# EAGLE schematic Humidity (EAGLE 7.2.0)
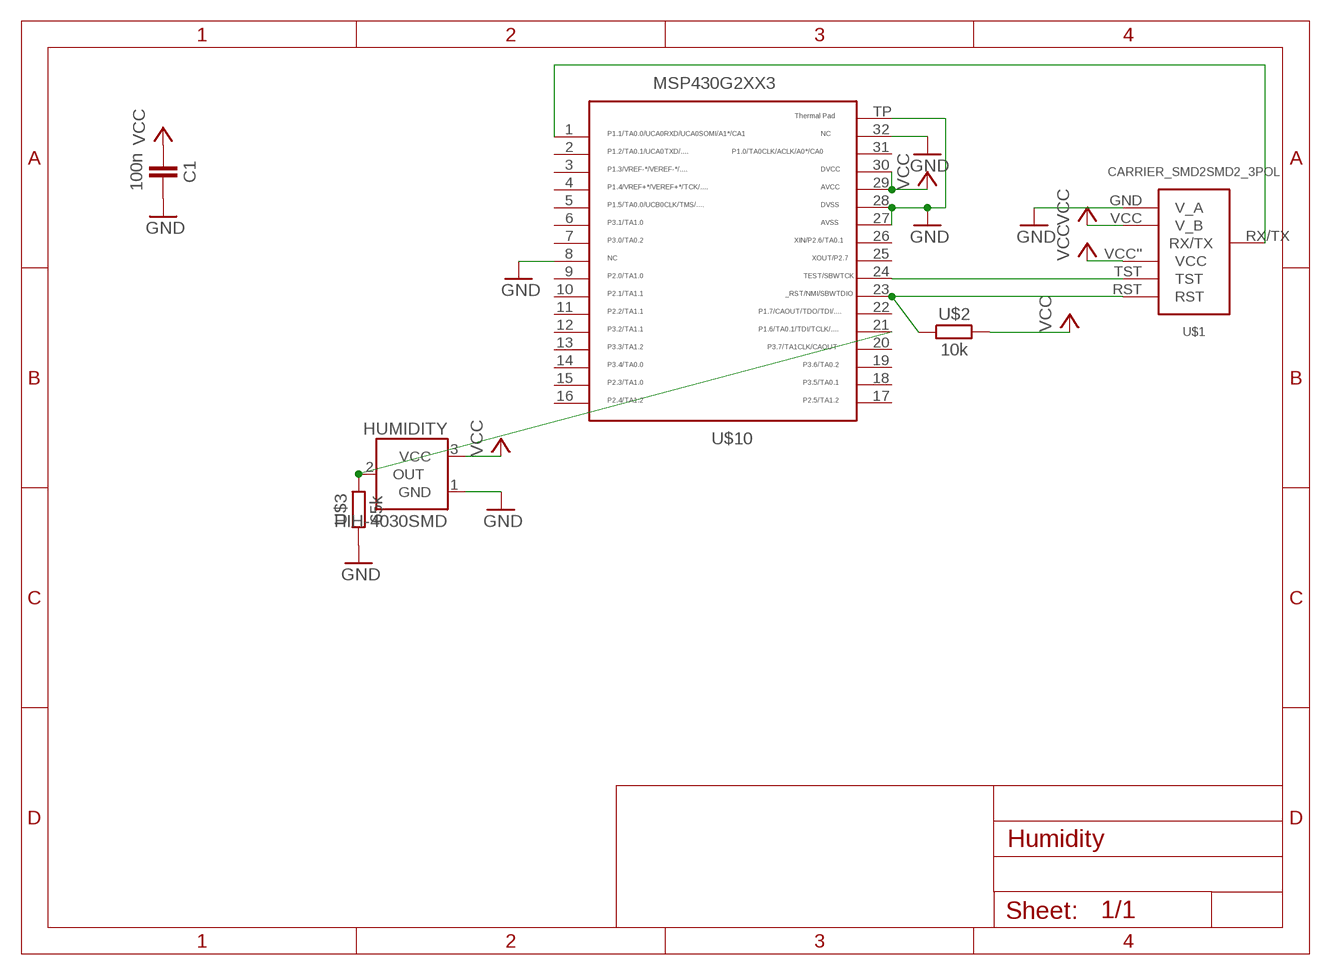
[diagram p0: schematic, sheet 1]

## Parts
C1  100n  CAPACITOR  [603]
HUMIDITY  HIH-4030SMD  [HIH-4030]
U$1  CARRIER_SMD2SMD2_3POL  [CARRIER_SMD2_3POL]
U$2  10k  RESISTOR0603  [603]
U$3  65k  RESISTOR0603  [603]
U$10  MSP430G2553  [QFN32]

## Nets
GND: C1.2 HUMIDITY.1(GND) U$1.GND(V_A) U$3.1 U$10.8 U$10.27 U$10.28 U$10.32 U$10.TP
N$3: U$1.TST U$10.24
N$4: U$1.RST U$2.1 U$10.23
N$5: HUMIDITY.2(OUT) U$3.2 U$10.21
N$12: U$1.RX/TX U$10.1
VCC: C1.1 HUMIDITY.3(VCC) U$1.VCC''(VCC) U$1.VCC(V_B) U$2.2 U$10.29 U$10.30
Unconnected: U$10.2 U$10.3 U$10.4 U$10.5 U$10.6 U$10.7 U$10.9 U$10.10 U$10.11 U$10.12 U$10.13 U$10.14 U$10.15 U$10.16 U$10.17 U$10.18 U$10.19 U$10.20 U$10.22 U$10.25 U$10.26 U$10.31

## Library data of the parts
C1 = thar:CAPACITOR
HUMIDITY = SparkFun-Sensors:HIH-4030: Humidity Sensor
U$1 = thar:CARRIER_SMD2
U$2 U$3 = thar:RESISTOR
U$10 = thar:MSP430G2553: TEXAS INSTRUMENTS MSP430G2553IRHB32R MCU, 16BIT, MSP430, 16MHZ, QFN-32 Farnell Best.Nr.: 2325726 Herst.Bez.: MSP430G2553IRHB32R